# EAGLE design El-Fueradoro_Transmitter (EAGLE 6.6.0)
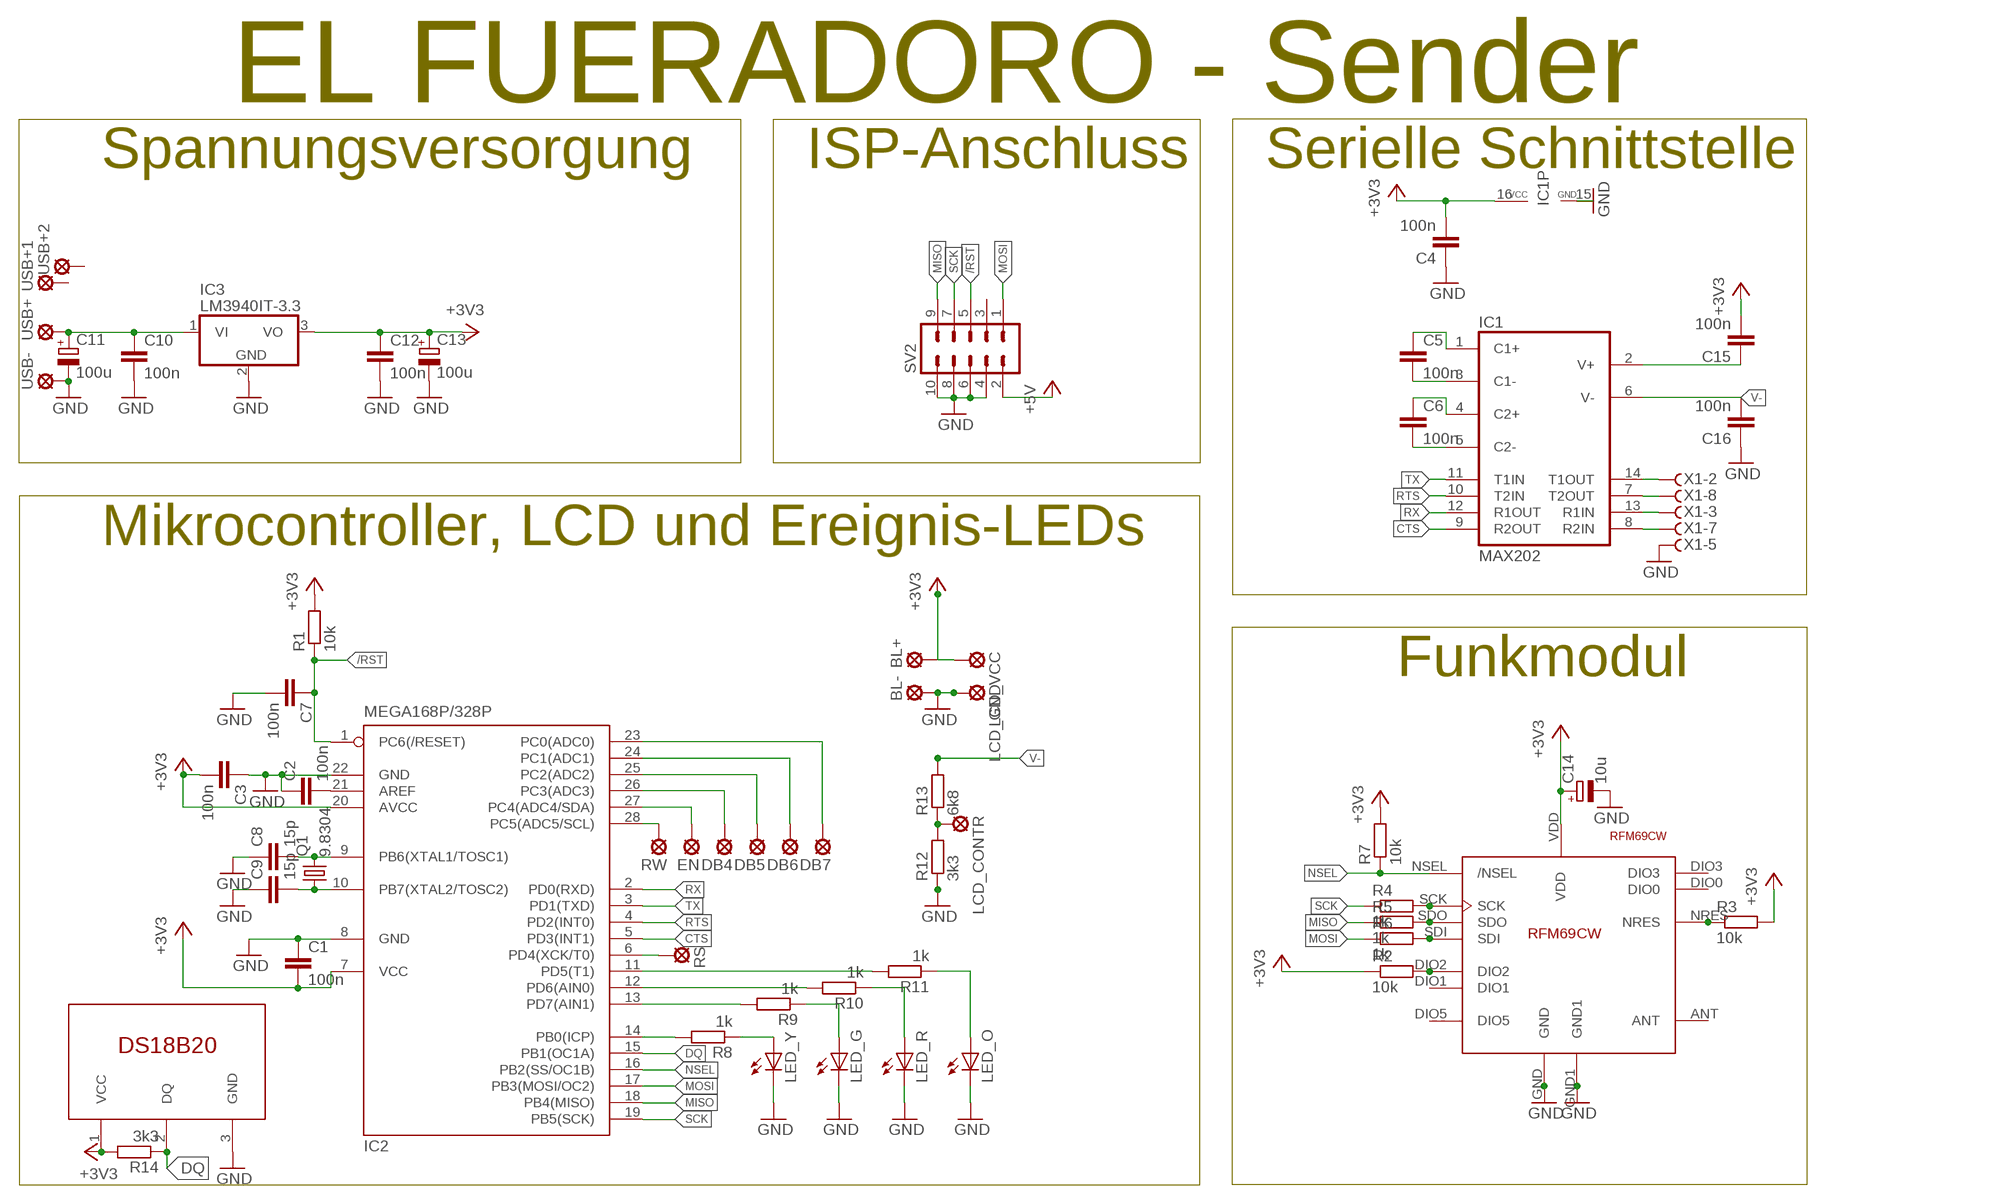
[diagram p0: schematic, sheet 1]

## Parts
BL+  LSP10  [LSP10]
BL-  LSP10  [LSP10]
C1  100n  C-EU025-024X044  [C025-024X044]
C2  100n  C-EU025-024X044  [C025-024X044]
C3  100n  C-EU025-024X044  [C025-024X044]
C4  100n  C-EU025-024X044  [C025-024X044]
C5  100n  C-EU025-024X044  [C025-024X044]
C6  100n  C-EU025-024X044  [C025-024X044]
C7  100n  C-EU025-024X044  [C025-024X044]
C8  15p  C-EU025-024X044  [C025-024X044]
C9  15p  C-EU025-024X044  [C025-024X044]
C10  100n  C-EU025-024X044  [C025-024X044]
C11  100u  CPOL-EUB45181A  [B45181A]
C12  100n  C-EU025-024X044  [C025-024X044]
C13  100u  CPOL-EUB45181A  [B45181A]
C14  10u  CPOL-EUB45181A  [B45181A]
C15  100n  C-EU025-024X044  [C025-024X044]
C16  100n  C-EU025-024X044  [C025-024X044]
DB4  LSP10  [LSP10]
DB5  LSP10  [LSP10]
DB6  LSP10  [LSP10]
DB7  LSP10  [LSP10]
EN  LSP10  [LSP10]
IC1  MAX202  MAX232  [DIL16]
IC2  MEGA168P/328P  MEGA8-P  [DIL28-3]
IC3  LM3940IT-3.3  786TV  [TO220V]
LCD_CONTR  LSP10  [LSP10]
LCD_GND  LSP10  [LSP10]
LCD_VCC  LSP10  [LSP10]
LED_G  LED5MM  [LED5MM]
LED_O  LED5MM  [LED5MM]
LED_R  LED5MM  [LED5MM]
LED_Y  LED5MM  [LED5MM]
Q1  9.8304  CRYSTALHC49S  [HC49/S]
R1  10k  R-EU_0207/10  [0207/10]
R2  10k  R-EU_0207/10  [0207/10]
R3  10k  R-EU_0207/10  [0207/10]
R4  1k  R-EU_0207/10  [0207/10]
R5  1k  R-EU_0207/10  [0207/10]
R6  1k  R-EU_0207/10  [0207/10]
R7  10k  R-EU_0207/10  [0207/10]
R8  1k  R-EU_0207/10  [0207/10]
R9  1k  R-EU_0207/10  [0207/10]
R10  1k  R-EU_0207/10  [0207/10]
R11  1k  R-EU_0207/10  [0207/10]
R12  3k3  R-EU_0207/10  [0207/10]
R13  6k8  R-EU_0207/10  [0207/10]
R14  3k3  R-EU_0207/10  [0207/10]
RS  LSP10  [LSP10]
RW  LSP10  [LSP10]
SV2  ML10  [ML10]
U$2  DS18B20  [TO92-LINE]
U$3  RFM69CW  [RFM69CW]
USB+  LSP10  [LSP10]
USB+1  LSP10  [LSP10]
USB+2  LSP10  [LSP10]
USB-  LSP10  [LSP10]
X1  F09HPS  [F09HP]

## Nets
+3V3: BL+.MP C1.2 C3.2 C4.2 C12.1 C13.+ C14.+ C15.2 IC1.16(VCC) IC2.7(VCC) IC2.20(AVCC) IC3.3(VO) LCD_VCC.MP R1.2 R2.1 R3.2 R7.2 R14.2 SV2.2 U$2.1(VCC) U$3.VDD ; supply symbol labelled +5V
/RST: C7.1 IC2.1(PC6(/RESET)) R1.1 SV2.5
CTS: IC1.9(R2OUT) IC2.5(PD3(INT1))
DQ: IC2.15(PB1(OC1A)) R14.1 U$2.2(DQ)
GND: BL-.MP C1.1 C2.1 C3.1 C4.1 C7.2 C8.1 C9.1 C10.2 C11.- C12.2 C13.- C14.- C16.1 IC1.15(GND) IC2.8(GND) IC2.22(GND) IC3.2(GND) LCD_GND.MP LED_G.K(C) LED_O.K(C) LED_R.K(C) LED_Y.K(C) R12.1 SV2.4 SV2.6 SV2.8 SV2.10 U$2.3(GND) U$3.GND U$3.GND1 USB-.MP X1.5(-5:F)
MISO: IC2.18(PB4(MISO)) R5.1 SV2.9
MOSI: IC2.17(PB3(MOSI/OC2)) R6.1 SV2.1
N$1: C10.1 C11.+ IC3.1(VI) USB+.MP
N$3: IC1.14(T1OUT) X1.2(-2:F)
N$4: IC1.13(R1IN) X1.3(-3:F)
N$7: IC1.7(T2OUT) X1.8(-8:F)
N$8: IC1.8(R2IN) X1.7(-7:F)
N$9: R2.2 U$3.DIO2
N$10: R4.2 U$3.SCK
N$11: R5.2 U$3.SDO
N$12: R6.2 U$3.SDI
N$13: R3.1 U$3.NRES
N$14: IC2.28(PC5(ADC5/SCL)) RW.MP
N$17: C2.2 IC2.21(AREF)
N$18: C9.2 IC2.10(PB7(XTAL2/TOSC2)) Q1.1
N$19: C5.1 IC1.1(C1+)
N$20: C5.2 IC1.3(C1-)
N$21: C6.1 IC1.4(C2+)
N$22: C6.2 IC1.5(C2-)
N$23: C8.2 IC2.9(PB6(XTAL1/TOSC1)) Q1.2
N$27: IC2.13(PD7(AIN1)) R9.2
N$28: IC2.12(PD6(AIN0)) R10.2
N$29: IC2.11(PD5(T1)) R11.2
N$30: LED_O.A R11.1
N$31: IC2.14(PB0(ICP)) R8.2
N$32: LED_R.A R10.1
N$33: LED_G.A R9.1
N$34: LED_Y.A R8.1
N$35: DB6.MP IC2.24(PC1(ADC1))
N$37: DB5.MP IC2.25(PC2(ADC2))
N$38: DB4.MP IC2.26(PC3(ADC3))
N$39: EN.MP IC2.27(PC4(ADC4/SDA))
N$40: DB7.MP IC2.23(PC0(ADC0))
N$41: IC2.6(PD4(XCK/T0)) RS.MP
N$42: LCD_CONTR.MP R12.2 R13.1
N$43: C15.1 IC1.2(V+)
NSEL: IC2.16(PB2(SS/OC1B)) R7.1 U$3.NSEL(/NSEL)
RTS: IC1.10(T2IN) IC2.4(PD2(INT0))
RX: IC1.12(R1OUT) IC2.2(PD0(RXD))
SCK: IC2.19(PB5(SCK)) R4.1 SV2.7
TX: IC1.11(T1IN) IC2.3(PD1(TXD))
V-: C16.2 IC1.6(V-) R13.2
Unconnected: SV2.3 U$3.ANT U$3.DIO0 U$3.DIO1 U$3.DIO3 U$3.DIO5 USB+1.MP USB+2.MP X1.1(-1:F) X1.4(-4:F) X1.6(-6:F) X1.9(-9:F) X1.G1(-G:G1) X1.G2(-G:G2)

## Notes on the sheet
- EL FUERADORO - Sender
- Spannungsversorgung | ISP-Anschluss | Serielle Schnittstelle
- Mikrocontroller, LCD und Ereignis-LEDs
- Funkmodul

## Library data of the parts
BL+ BL- DB4-DB7 EN LCD_CONTR LCD_GND LCD_VCC RS RW USB+ USB+1 USB+2 USB- = solpad:LSP10: SOLDER PAD drill 1.0 mm, distributor Buerklin, 12H555
C1-C10 C12 C15 C16 = rcl:C-EU: CAPACITOR, European symbol
C11 C13 C14 = rcl:CPOL-EU: POLARIZED CAPACITOR, European symbol
IC1 = maxim:MAX232: RS232 TRANSEIVER; MF: MAXIM; MPN: MAX232ACPE+; OC_FARNELL: 9723773; OC_NEWARK: 68K4544
IC2 = atmel:MEGA8-P: MICROCONTROLLER 8 Kbytes FLASH, 1 kbytes SRAM, 512 bytes EEPROM, USART, 4-channel 10 bit ADC, 2-channel 8 bit ADC Pin compatible with Atmega48, ATMega88, ATMega168 Source: avr.lbr; OC_FARNELL: unknown; OC_NEWARK: unknown
IC3 = linear:78*: Positive VOLTAGE REGULATOR Source: http://cache.national.com/ds/LM/LM78L05.pdf http://www.fairchildsemi.com/ds/LM/LM7805.pdf
LED_G LED_O LED_R LED_Y = led:LED: LED OSRAM: - CHIPLED LG R971, LG N971, LY N971, LG Q971, LY Q971, LO R971, LY R971 LH N974, LH R974 LS Q976, LO Q976, LY Q976 LO Q996 - Hyper CHIPLED LW Q18S LB Q993, LB Q99A, LB R99A - SideLED LS A670, LO A670, LY A670, LG A670, LP A670 LB A673, LV A673, LT A673, LW A673 LH A674 LY A675 LS A676, LA A676, LO A676, LY A676, LW A676 LS A679, LY A679, LG A679 - Hyper Micro SIDELED® LS Y876, LA Y876, LO Y876, LY Y876 LT Y87S - SmartLED LW L88C, LW L88S LB L89C, LB L89S, LG L890 LS L89K, LO L89K, LY L89K LS L896, LA L896, LO L896, LY L896 - TOPLED LS T670, LO T670, LY T670, LG T670, LP T670 LSG T670, LSP T670, LSY T670, LOP T670, LYG T670 LG T671, LOG T671, LSG T671 LB T673, LV T673, LT T673, LW T673 LH T674 LS T676, LA T676, LO T676, LY T676, LB T676, LH T676, LSB T676, LW T676 LB T67C, LV T67C, LT T67C, LS T67K, LO T67K, LY T67K, LW E67C LS E67B, LA E67B, LO E67B, LY E67B, LB E67C, LV E67C, LT E67C LW T67C LS T679, LY T679, LG T679 LS T770, LO T770, LY T770, LG T770, LP T770 LB T773, LV T773, LT T773, LW T773 LH T774 LS E675, LA E675, LY E675, LS T675 LS T776, LA T776, LO T776, LY T776, LB T776 LHGB T686 LT T68C, LB T68C - Hyper Mini TOPLED® LB M676 - Mini TOPLED Santana® LG M470 LS M47K, LO M47K, LY M47K Source: http://www.osram.convergy.de LUXEON: - LUMILED® LXK2-PW12-R00, LXK2-PW12-S00, LXK2-PW14-U00, LXK2-PW14-V00 LXK2-PM12-R00, LXK2-PM12-S00, LXK2-PM14-U00 LXK2-PE12-Q00, LXK2-PE12-R00, LXK2-PE12-S00, LXK2-PE14-T00, LXK2-PE14-U00 LXK2-PB12-K00, LXK2-PB12-L00, LXK2-PB12-M00, LXK2-PB14-N00, LXK2-PB14-P00, LXK2-PB14-Q00 LXK2-PR12-L00, LXK2-PR12-M00, LXK2-PR14-Q00, LXK2-PR14-R00 LXK2-PD12-Q00, LXK2-PD12-R00, LXK2-PD12-S00 LXK2-PH12-R00, LXK2-PH12-S00 LXK2-PL12-P00, LXK2-PL12-Q00, LXK2-PL12-R00 Source: www.luxeon.com KINGBRIGHT: KA-3528ASYC Source: www.kingbright.com
Q1 = crystal:CRYSTAL: CRYSTAL; OC_FARNELL: 1667008; OC_NEWARK: unknown
R1-R14 = rcl:R-EU_: RESISTOR, European symbol
SV2 = fp:ML10: HARTING; OC_FARNELL: unknown; OC_NEWARK: unknown
U$2 = fp:DS18B20
U$3 = fp:RFM69CW
X1 = fp:F09HPS: SUB-D; OC_FARNELL: unknown; OC_NEWARK: unknown

## Board
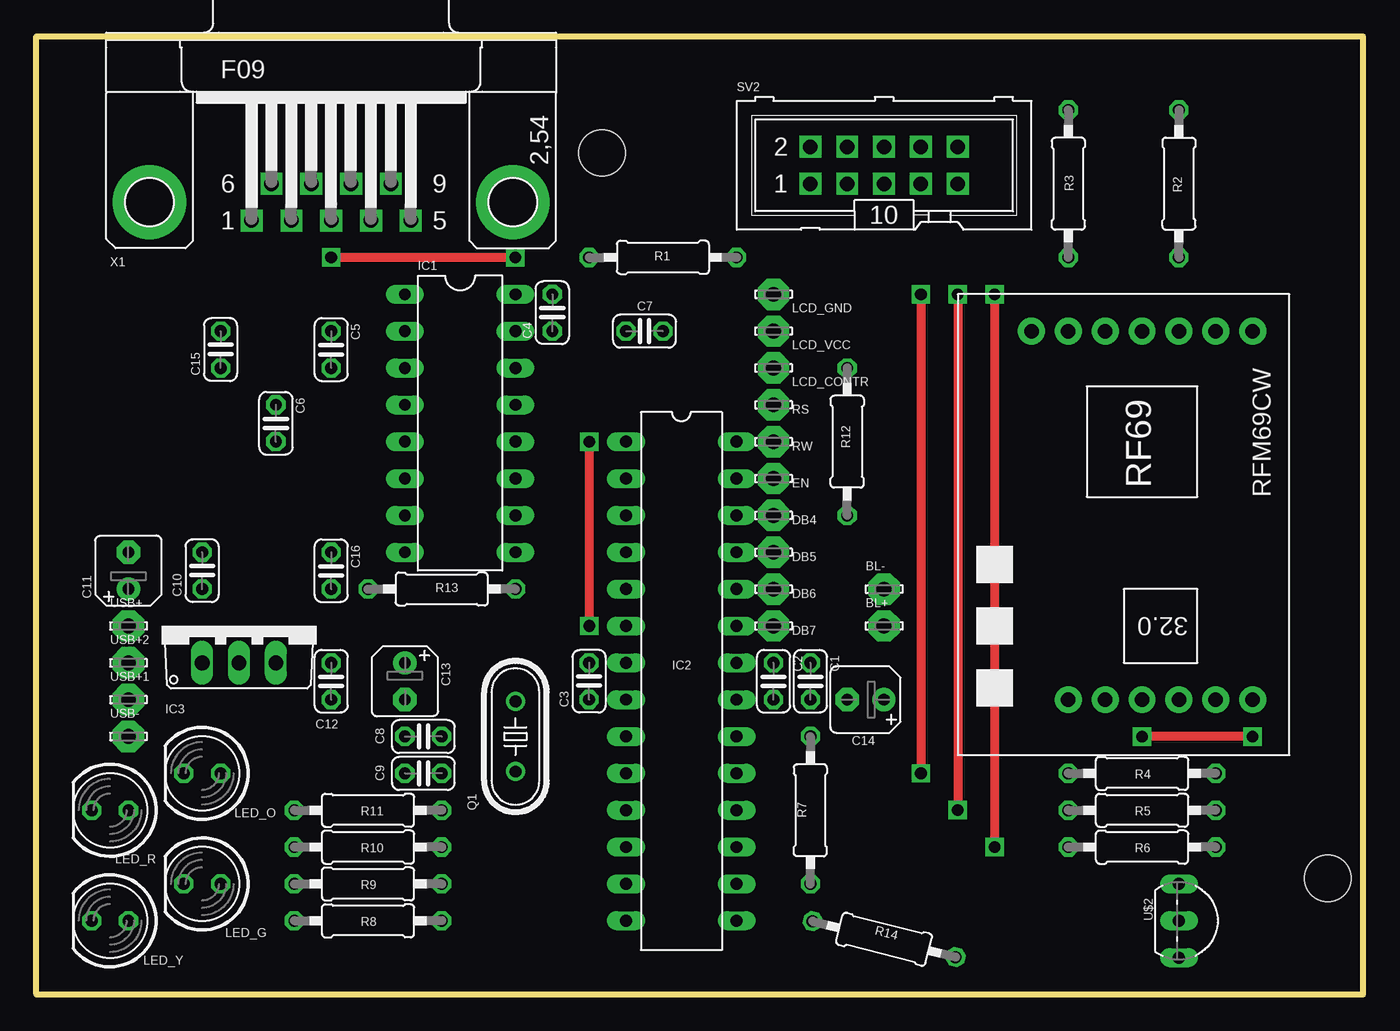
[diagram p1: board, top side]
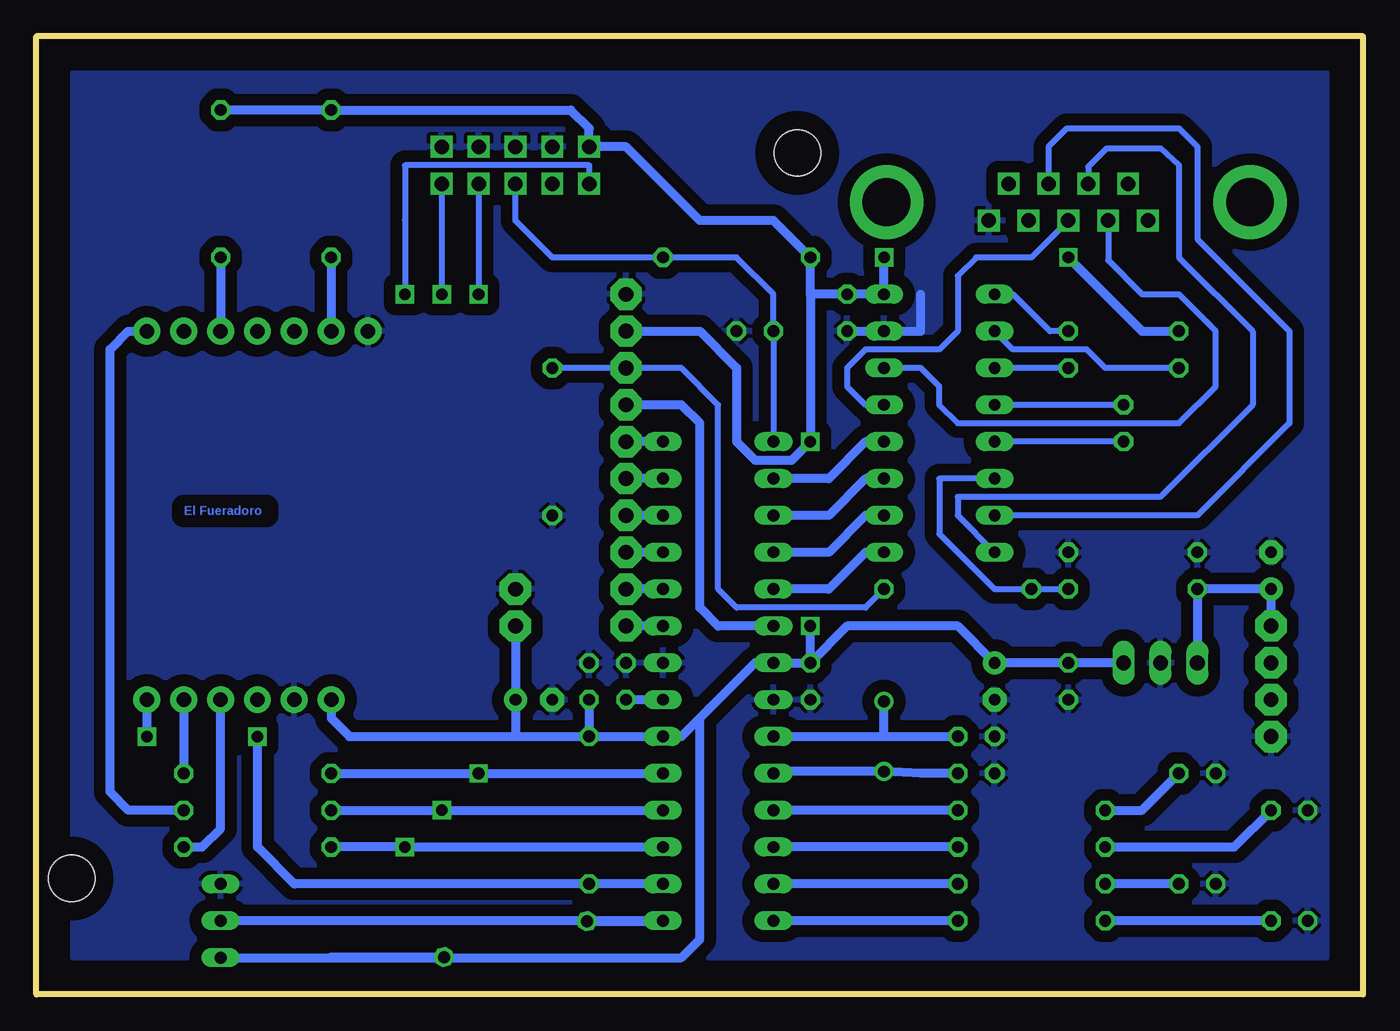
[diagram p2: board, bottom side, seen from below]

Size 91.44 x 66.04 mm. Coordinates in mm from the lower left corner, seen from the top.
Outline: 0,0 0,66.04 91.44,66.04 91.44,0 0,0
Copper layers (1*16): Top 0.035mm / dielectric 1.5mm / Bottom 0.035mm
Design rules "default": minimum track width 16mil, minimum drill 20mil, track to track 10mil, track to pad 10mil, pad to pad 24mil, via to via 8mil, smd to smd 8mil, copper to edge 50mil, drill to drill 50mil, minimum pad ring 10mil, minimum via ring 8mil, stop-mask expansion 0mil, vias tented up to drill 0mil, thermal gap 10mil
Holes 3.2 mm at 39,58 89,8

### Footprints (pad centres in the part's own frame; a part is rotated, then mirrored left to right if it is on the bottom)
LSP10 = drill 1.016 pad 2.159 octagon: MP 0,0
C025-024X044 = drill 0.813 octagon: 1 -1.27,0; 2 1.27,0
B45181A = drill 0.813 pad 1.6: + -1.27,0 | drill 0.813 pad 1.6 octagon: - 1.27,0
DIL16 = drill 0.813 long: 1 -8.89,-3.81; 2 -6.35,-3.81; 3 -3.81,-3.81; 4 -1.27,-3.81; 5 1.27,-3.81; 6 3.81,-3.81; 7 6.35,-3.81; 8 8.89,-3.81; 9 8.89,3.81; 10 6.35,3.81; 11 3.81,3.81; 12 1.27,3.81; 13 -1.27,3.81; 14 -3.81,3.81; 15 -6.35,3.81; 16 -8.89,3.81
DIL28-3 = drill 0.813 long: 1 -16.51,-3.81; 2 -13.97,-3.81; 3 -11.43,-3.81; 4 -8.89,-3.81; 5 -6.35,-3.81; 6 -3.81,-3.81; 7 -1.27,-3.81; 8 1.27,-3.81; 9 3.81,-3.81; 10 6.35,-3.81; 11 8.89,-3.81; 12 11.43,-3.81; 13 13.97,-3.81; 14 16.51,-3.81; 15 16.51,3.81; 16 13.97,3.81; 17 11.43,3.81; 18 8.89,3.81; 19 6.35,3.81; 20 3.81,3.81; 21 1.27,3.81; 22 -1.27,3.81; 23 -3.81,3.81; 24 -6.35,3.81; 25 -8.89,3.81; 26 -11.43,3.81; 27 -13.97,3.81; 28 -16.51,3.81
TO220V = drill 1.016 long: 1 -2.54,-2.54; 2 0,-2.54; 3 2.54,-2.54
LED5MM = drill 0.813 octagon: A -1.27,0; K 1.27,0
HC49/S = drill 0.813: 1 -2.413,0; 2 2.413,0
0207/10 = drill 0.813 octagon: 1 -5.08,0; 2 5.08,0
ML10 = drill 1 pad 1.5 square: 1 -5.08,-1.27; 2 -5.08,1.27; 3 -2.54,-1.27; 4 -2.54,1.27; 5 0,-1.27; 6 0,1.27; 7 2.54,-1.27; 8 2.54,1.27; 9 5.08,-1.27; 10 5.08,1.27
TO92-LINE = drill 0.813 long: 1 -2.54,1.27; 2 0,1.27; 3 2.54,1.27
RFM69CW = drill 1 pad 1.85: DIO0 -12.7,5.08; DIO1 -12.7,0; DIO2 -12.7,2.54; DIO3 12.7,0; DIO5 -12.7,-2.54; GND -12.7,-7.62; GND1 12.7,-2.54; NRES -12.7,-5.08; NSEL 12.7,7.62; SCK 12.7,5.08; SDI 12.7,2.54; SDO -12.7,7.62; VDD 12.7,-5.08
F09HP = drill 1 pad 1.5 square: 1 -5.486,-1.27; 2 -2.743,-1.27; 3 0,-1.27; 4 2.743,-1.27; 5 5.486,-1.27; 6 -4.115,1.27; 7 -1.372,1.27; 8 1.372,1.27; 9 4.115,1.27 | drill 3.302 pad 5.08: G1 -12.522,0; G2 12.522,0

### Placement (x,y rotation side)
BL+  58.42,25.4 0 top
BL-  58.42,27.94 0 top
C1  53.34,21.59 270 top
C2  50.8,21.59 270 top
C3  38.1,21.59 90 top
C4  35.56,46.99 90 top
C5  20.32,44.45 270 top
C6  16.51,39.37 270 top
C7  41.91,45.72 0 top
C8  26.67,17.78 0 top
C9  26.67,15.24 0 top
C10  11.43,29.21 90 top
C11  6.35,29.21 90 top
C12  20.32,21.59 270 top
C13  25.4,21.59 270 top
C14  57.15,20.32 180 top
C15  12.7,44.45 90 top
C16  20.32,29.21 270 top
DB4  50.8,33.02 0 top
DB5  50.8,30.48 0 top
DB6  50.8,27.94 0 top
DB7  50.8,25.4 0 top
EN  50.8,35.56 0 top
IC1  29.21,39.37 270 top
IC2  44.45,21.59 270 top
IC3  13.97,25.4 0 top
LCD_CONTR  50.8,43.18 0 top
LCD_GND  50.8,48.26 0 top
LCD_VCC  50.8,45.72 0 top
LED_G  11.43,7.62 180 top
LED_O  11.43,15.24 180 top
LED_R  5.08,12.7 180 top
LED_Y  5.08,5.08 180 top
Q1  33.02,17.78 90 top
R1  43.18,50.8 180 top
R2  78.74,55.88 270 top
R3  71.12,55.88 90 top
R4  76.2,15.24 0 top
R5  76.2,12.7 0 top
R6  76.2,10.16 0 top
R7  53.34,12.7 90 top
R8  22.86,5.08 0 top
R9  22.86,7.62 0 top
R10  22.86,10.16 0 top
R11  22.86,12.7 0 top
R12  55.88,38.1 90 top
R13  27.94,27.94 180 top
R14  58.42,3.81 345.9 top
RS  50.8,40.64 0 top
RW  50.8,38.1 0 top
SV2  58.42,57.15 0 top
U$2  80.01,5.08 90 top
U$3  76.2,33.02 270 top
USB+  6.35,25.4 0 top
USB+1  6.35,20.32 0 top
USB+2  6.35,22.86 0 top
USB-  6.35,17.78 0 top
X1  20.32,54.61 0 top

### Tracks (layer width: path | path; a pad name or v marks a point on that pad's centre or on a via)
+3V3  (via drill 0.8 pad 1.27)
  Top 0.61: v38.1,38.1 v38.1,25.4 | v33.02,50.8 v20.32,50.8
  Bottom 0.406: 45.72,19.05 45.09,19.68
  Bottom 0.61: IC3.3 C12.1 C13.+ 27.94,25.4 35.56,25.4 C3.2 | C3.2 IC2.7 41.91,22.86 45.09,19.68 46.99,17.78 IC2.20 R7.2 | U$3.VDD 71.12,19.05 69.85,17.78 58.42,17.78 | 58.42,17.78 C14.+ BL+.MP | 58.42,17.78 R7.2 | C1.2 R7.2 | R2.1 R3.2 54.61,60.96 53.34,59.69 SV2.2 50.8,58.42 45.72,53.34 40.64,53.34 R1.2 38.1,48.26 | 38.1,48.26 C4.2 IC1.16 v33.02,50.8 | v20.32,50.8 15.24,45.72 C15.2 | C3.2 v38.1,25.4 | 38.1,48.26 v38.1,38.1 39.37,36.83 41.91,36.83 43.18,38.1 43.18,43.18 45.72,45.72 LCD_VCC.MP | U$2.1 71.12,2.54 | 71.12,2.54 46.99,2.54 45.72,3.81 45.72,19.05 | R14.2 71.09,2.57 71.12,2.54
/RST
  Bottom 0.406: IC2.1 C7.1 40.64,48.26 43.18,50.8 R1.1 55.88,50.8 58.42,53.34 SV2.5
CTS
  Bottom 0.61: IC1.9 34.29,30.48 36.83,27.94 IC2.5
DQ
  Bottom 0.406: 48.29,5.05 IC2.15
  Bottom 0.61: IC2.15 66.04,5.08 U$2.2 | R14.1 48.29,5.05
GND
  Bottom 0.61: C4.1 IC1.15 30.48,45.72 30.48,48.26
  pour Bottom (isolate 0.813): 2.54,63.5 2.54,2.54 88.9,2.54 88.9,63.5
MISO  (via drill 0.8 pad 1.27)
  Top 0.61: v63.5,48.26 v63.5,12.7
  Bottom 0.406: v63.5,48.26 63.5,53.34 SV2.9
  Bottom 0.61: R5.1 v63.5,12.7 IC2.18
MOSI  (via drill 0.8 pad 1.27)
  Top 0.61: v66.04,48.26 v66.04,10.16
  Bottom 0.406: v66.04,48.26 66.04,53.34 66.04,57.15 53.34,57.15 SV2.1
  Bottom 0.61: R6.1 v66.04,10.16 IC2.17
N$1
  Bottom 0.61: USB+.MP C11.+ C10.1 IC3.1
N$3
  Bottom 0.406: X1.2 17.58,50.6 15.24,48.26 12.7,48.26 10.16,45.72 10.16,41.91 12.7,39.37 27.94,39.37 29.21,40.64 29.21,41.91 30.48,43.18 IC1.14
N$4
  Bottom 0.406: X1.3 22.86,50.8 26.67,50.8 27.94,49.53 27.94,45.72 29.21,44.45 34.29,44.45 35.56,43.18 35.56,41.91 34.29,40.64 IC1.13
N$7
  Bottom 0.406: IC1.7 11.43,33.02 5.08,39.37 5.08,45.72 11.43,52.07 11.43,58.42 12.7,59.69 20.42,59.69 21.69,58.42 X1.8
N$8
  Bottom 0.406: IC1.8 27.94,33.02 27.94,34.29 13.97,34.29 7.62,40.64 7.62,45.72 12.7,50.8 12.7,57.15 13.97,58.32 17.68,58.32 18.95,57.05 X1.7
N$9
  Bottom 0.61: R2.2 U$3.DIO2
N$10
  Bottom 0.61: U$3.SCK R4.2
N$11
  Bottom 0.61: R5.2 85.09,12.7 86.36,13.97 86.36,44.45 85.09,45.72 U$3.SDO
N$12
  Bottom 0.61: R6.2 80.01,10.16 78.74,11.43 U$3.SDI
N$13
  Bottom 0.61: R3.1 U$3.NRES
N$14
  Bottom 0.61: IC2.28 RW.MP
N$17
  Bottom 0.61: IC2.21 C2.2
N$18
  Bottom 0.61: C9.2 30.48,15.24 Q1.1 40.64,15.37 IC2.10
N$19
  Bottom 0.406: C5.1 21.59,45.72 24.13,48.26 IC1.1
N$20
  Bottom 0.406: C5.2 IC1.3
N$21
  Bottom 0.406: C6.1 IC1.4
N$22
  Bottom 0.406: C6.2 IC1.5
N$23
  Bottom 0.61: IC2.9 33.02,17.78 | 33.02,17.78 Q1.2 33.02,20.32 | 33.02,17.78 C8.2
N$27
  Bottom 0.61: R9.2 IC2.13
N$28
  Bottom 0.61: R10.2 IC2.12
N$29
  Bottom 0.61: R11.2 IC2.11
N$30
  Bottom 0.61: R11.1 15.24,12.7 LED_O.A
N$31
  Bottom 0.61: R8.2 IC2.14
N$32
  Bottom 0.61: R10.1 8.89,10.16 LED_R.A
N$33
  Bottom 0.61: LED_G.A R9.1
N$34
  Bottom 0.61: LED_Y.A R8.1
N$35
  Bottom 0.61: IC2.24 DB6.MP
N$37
  Bottom 0.61: IC2.25 DB5.MP
N$38
  Bottom 0.61: IC2.26 DB4.MP
N$39
  Bottom 0.61: IC2.27 EN.MP
N$40
  Bottom 0.61: IC2.23 DB7.MP
N$41
  Bottom 0.61: IC2.6 44.45,25.4 45.72,26.67 45.72,39.37 46.99,40.64 RS.MP
N$42
  Bottom 0.406: R13.1 34.29,26.67 43.18,26.67 44.45,27.94 44.45,40.64 46.99,43.18 LCD_CONTR.MP R12.2
N$43
  Bottom 0.406: C15.1 17.78,43.18 19.05,44.45 24.13,44.45 IC1.2
NSEL  (via drill 0.8 pad 1.27)
  Top 0.61: v83.82,17.78 v76.2,17.78
  Bottom 0.61: U$3.NSEL v83.82,17.78 | IC2.16 R7.1 73.66,7.62 76.2,10.16 v76.2,17.78
RTS
  Bottom 0.61: IC1.10 34.29,33.02 36.83,30.48 IC2.4
RX
  Bottom 0.61: IC1.12 34.29,38.1 36.83,35.56 IC2.2
SCK  (via drill 0.8 pad 1.27)
  Top 0.61: v60.96,48.26 v60.96,15.24
  Bottom 0.406: v60.96,48.26 60.96,53.34 SV2.7
  Bottom 0.61: R4.1 v60.96,15.24 IC2.19
TX
  Bottom 0.61: IC1.11 34.29,35.56 36.83,33.02 IC2.3
V-
  Bottom 0.406: IC1.6 29.21,35.56 29.21,31.75 25.4,27.94 R13.2 C16.2

### Text on the board
Bottom: El Fueradoro